# Altium project LED_matrix.PrjPcb
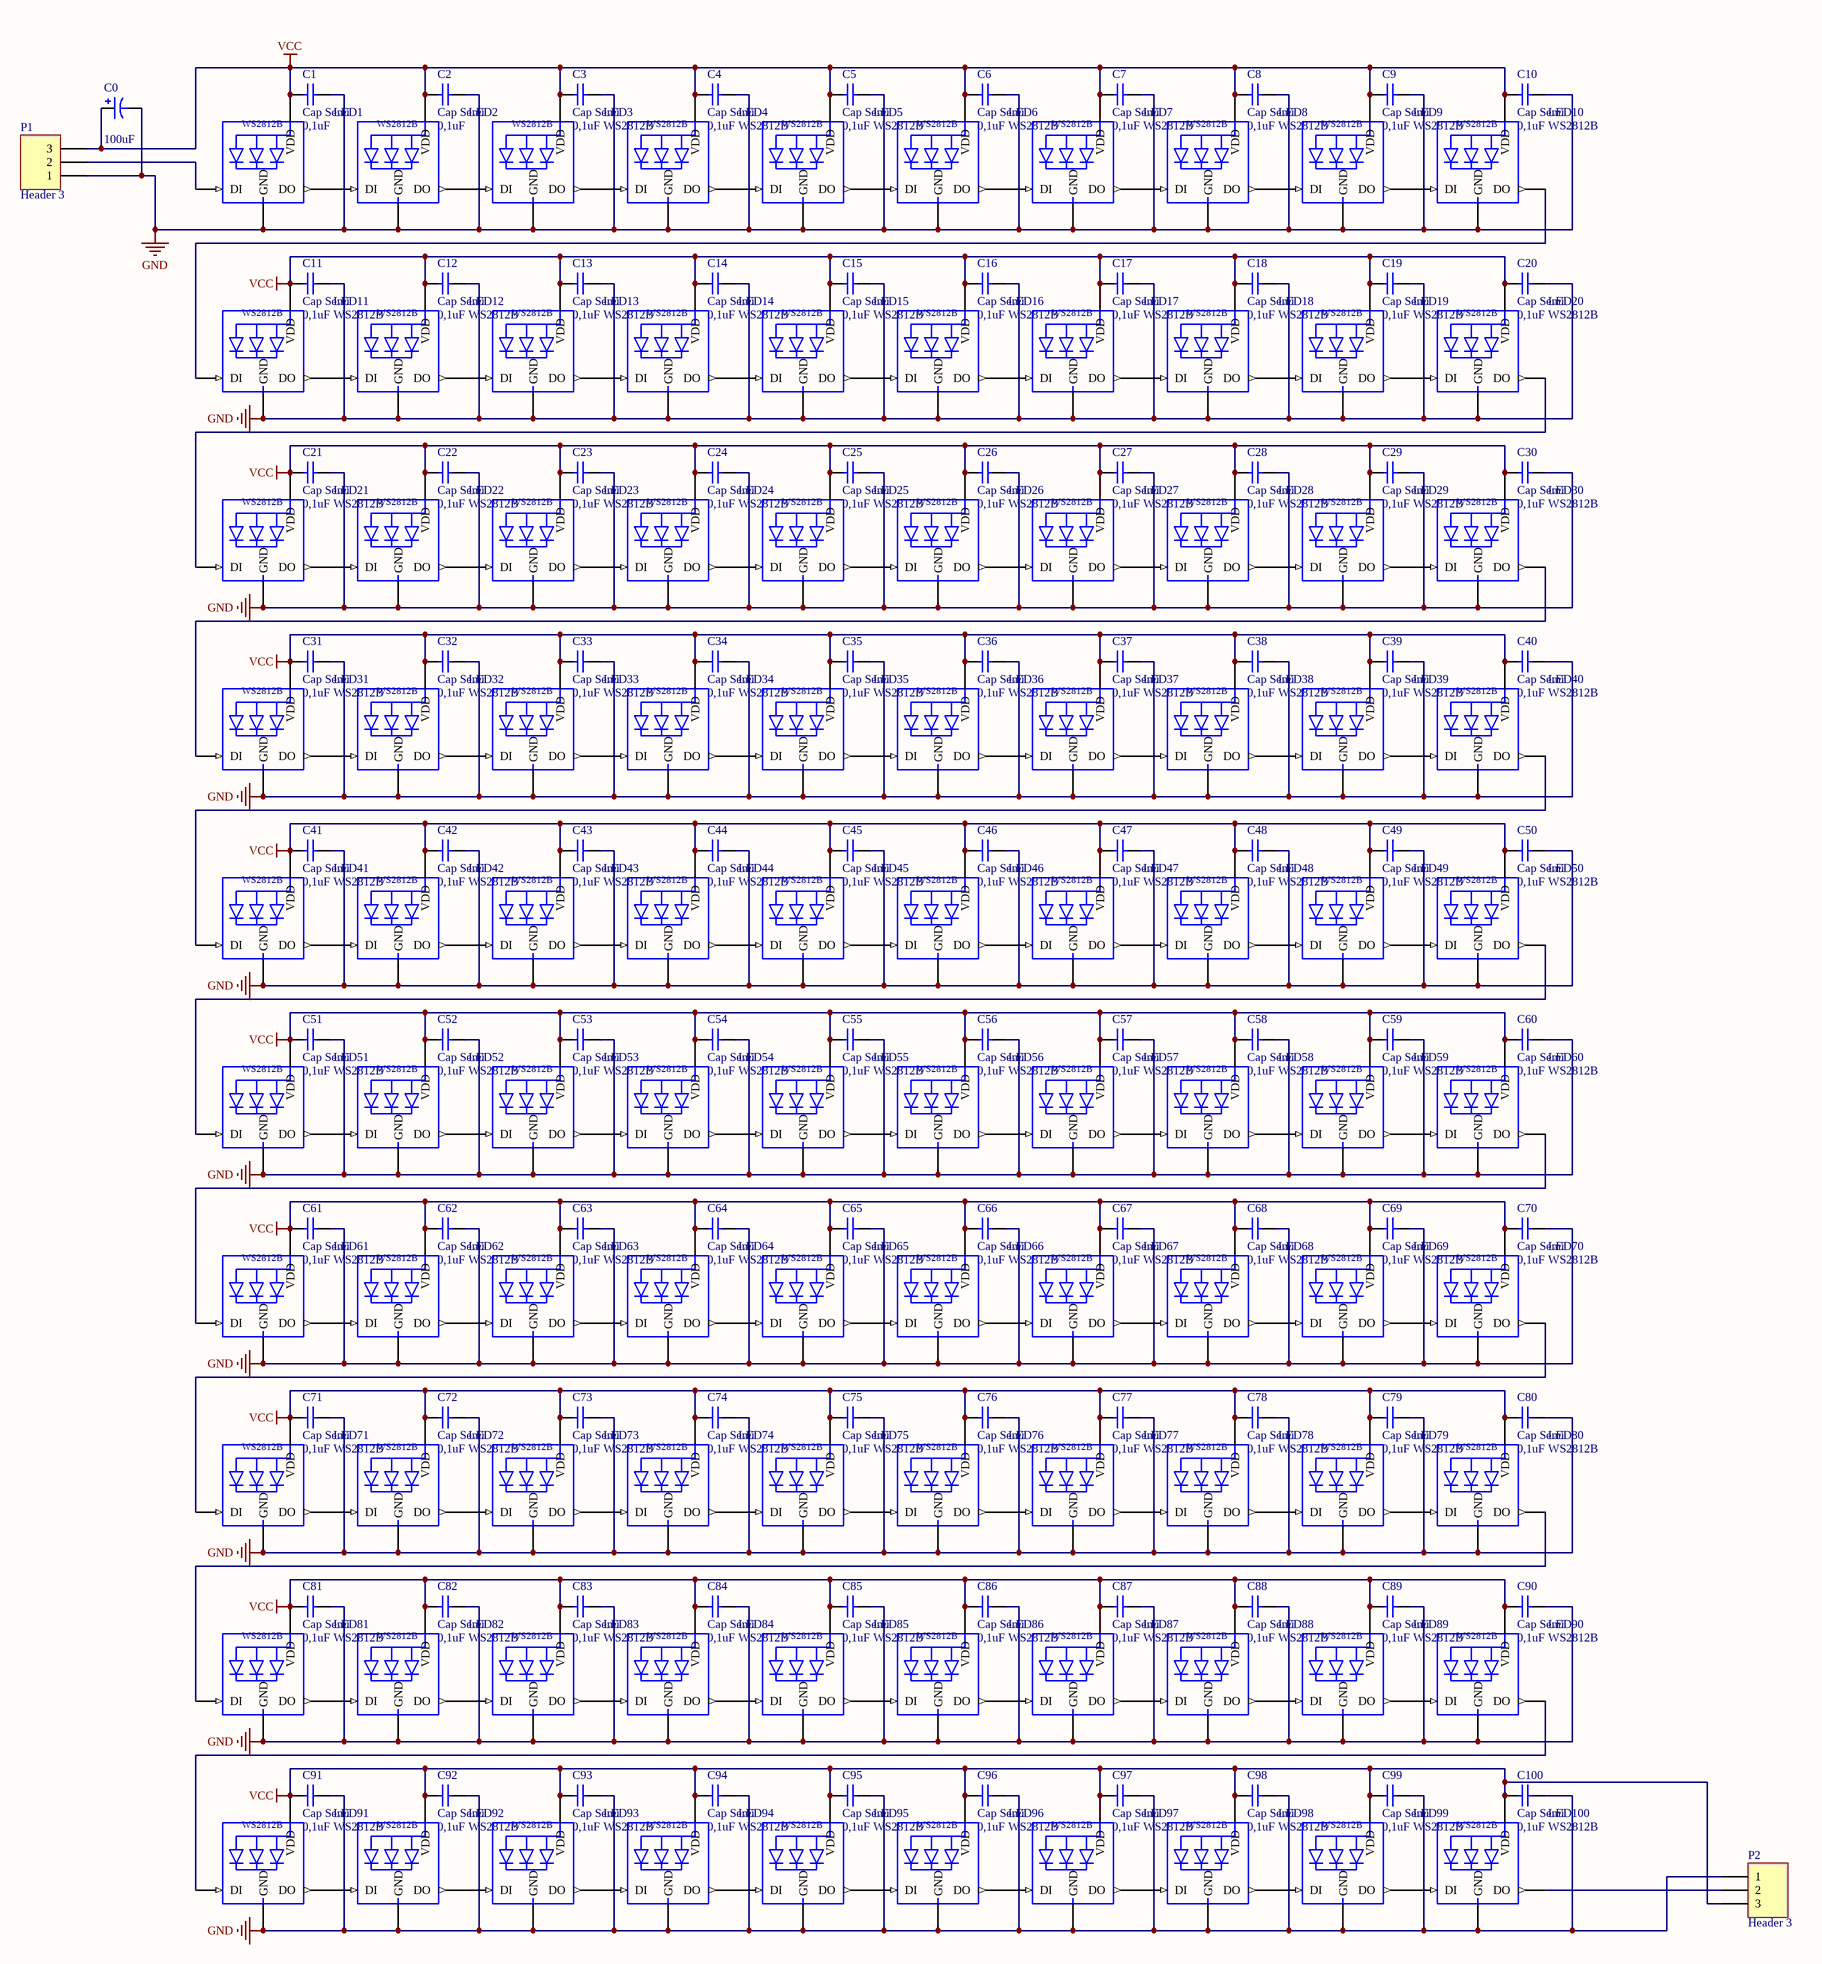
[diagram p0: Sheet1.SchDoc]
1 sheet, 203 parts. Net scope: global (net labels, ports and power ports of the same name join across sheets).

## Sheet Sheet1.SchDoc
size A2; PageSetup: Record=PageOptions|CenterHorizontal=True|CenterVertical=True|PrintScale=1.39|XCorrection=1.00|YCorrection=1.00|PrintKind=1|BorderSize=5000000|LeftOffset=0|BottomOffset=0|Orientation=2|PaperLength=1000|PaperWidth=1000|Scale=100|PaperSource=7|PrintQuality=-3|MediaType=1|DitherType=10|PrintScaleMode=1|PaperKind=A3 (Scaled)|PaperIndex=8

### Parts
C0  value 100uF  [RB7.6-15]  (hidden comment: Cap Pol1)
C1  Cap Semi  value 0,1uF  [1608[0603]]
C2  Cap Semi  value 0,1uF  [1608[0603]]
C3  Cap Semi  value 0,1uF  [1608[0603]]
C4  Cap Semi  value 0,1uF  [1608[0603]]
C5  Cap Semi  value 0,1uF  [1608[0603]]
C6  Cap Semi  value 0,1uF  [1608[0603]]
C7  Cap Semi  value 0,1uF  [1608[0603]]
C8  Cap Semi  value 0,1uF  [1608[0603]]
C9  Cap Semi  value 0,1uF  [1608[0603]]
C10  Cap Semi  value 0,1uF  [1608[0603]]
C11  Cap Semi  value 0,1uF  [1608[0603]]
C12  Cap Semi  value 0,1uF  [1608[0603]]
C13  Cap Semi  value 0,1uF  [1608[0603]]
C14  Cap Semi  value 0,1uF  [1608[0603]]
C15  Cap Semi  value 0,1uF  [1608[0603]]
C16  Cap Semi  value 0,1uF  [1608[0603]]
C17  Cap Semi  value 0,1uF  [1608[0603]]
C18  Cap Semi  value 0,1uF  [1608[0603]]
C19  Cap Semi  value 0,1uF  [1608[0603]]
C20  Cap Semi  value 0,1uF  [1608[0603]]
C21  Cap Semi  value 0,1uF  [1608[0603]]
C22  Cap Semi  value 0,1uF  [1608[0603]]
C23  Cap Semi  value 0,1uF  [1608[0603]]
C24  Cap Semi  value 0,1uF  [1608[0603]]
C25  Cap Semi  value 0,1uF  [1608[0603]]
C26  Cap Semi  value 0,1uF  [1608[0603]]
C27  Cap Semi  value 0,1uF  [1608[0603]]
C28  Cap Semi  value 0,1uF  [1608[0603]]
C29  Cap Semi  value 0,1uF  [1608[0603]]
C30  Cap Semi  value 0,1uF  [1608[0603]]
C31  Cap Semi  value 0,1uF  [1608[0603]]
C32  Cap Semi  value 0,1uF  [1608[0603]]
C33  Cap Semi  value 0,1uF  [1608[0603]]
C34  Cap Semi  value 0,1uF  [1608[0603]]
C35  Cap Semi  value 0,1uF  [1608[0603]]
C36  Cap Semi  value 0,1uF  [1608[0603]]
C37  Cap Semi  value 0,1uF  [1608[0603]]
C38  Cap Semi  value 0,1uF  [1608[0603]]
C39  Cap Semi  value 0,1uF  [1608[0603]]
C40  Cap Semi  value 0,1uF  [1608[0603]]
C41  Cap Semi  value 0,1uF  [1608[0603]]
C42  Cap Semi  value 0,1uF  [1608[0603]]
C43  Cap Semi  value 0,1uF  [1608[0603]]
C44  Cap Semi  value 0,1uF  [1608[0603]]
C45  Cap Semi  value 0,1uF  [1608[0603]]
C46  Cap Semi  value 0,1uF  [1608[0603]]
C47  Cap Semi  value 0,1uF  [1608[0603]]
C48  Cap Semi  value 0,1uF  [1608[0603]]
C49  Cap Semi  value 0,1uF  [1608[0603]]
C50  Cap Semi  value 0,1uF  [1608[0603]]
C51  Cap Semi  value 0,1uF  [1608[0603]]
C52  Cap Semi  value 0,1uF  [1608[0603]]
C53  Cap Semi  value 0,1uF  [1608[0603]]
C54  Cap Semi  value 0,1uF  [1608[0603]]
C55  Cap Semi  value 0,1uF  [1608[0603]]
C56  Cap Semi  value 0,1uF  [1608[0603]]
C57  Cap Semi  value 0,1uF  [1608[0603]]
C58  Cap Semi  value 0,1uF  [1608[0603]]
C59  Cap Semi  value 0,1uF  [1608[0603]]
C60  Cap Semi  value 0,1uF  [1608[0603]]
C61  Cap Semi  value 0,1uF  [1608[0603]]
C62  Cap Semi  value 0,1uF  [1608[0603]]
C63  Cap Semi  value 0,1uF  [1608[0603]]
C64  Cap Semi  value 0,1uF  [1608[0603]]
C65  Cap Semi  value 0,1uF  [1608[0603]]
C66  Cap Semi  value 0,1uF  [1608[0603]]
C67  Cap Semi  value 0,1uF  [1608[0603]]
C68  Cap Semi  value 0,1uF  [1608[0603]]
C69  Cap Semi  value 0,1uF  [1608[0603]]
C70  Cap Semi  value 0,1uF  [1608[0603]]
C71  Cap Semi  value 0,1uF  [1608[0603]]
C72  Cap Semi  value 0,1uF  [1608[0603]]
C73  Cap Semi  value 0,1uF  [1608[0603]]
C74  Cap Semi  value 0,1uF  [1608[0603]]
C75  Cap Semi  value 0,1uF  [1608[0603]]
C76  Cap Semi  value 0,1uF  [1608[0603]]
C77  Cap Semi  value 0,1uF  [1608[0603]]
C78  Cap Semi  value 0,1uF  [1608[0603]]
C79  Cap Semi  value 0,1uF  [1608[0603]]
C80  Cap Semi  value 0,1uF  [1608[0603]]
C81  Cap Semi  value 0,1uF  [1608[0603]]
C82  Cap Semi  value 0,1uF  [1608[0603]]
C83  Cap Semi  value 0,1uF  [1608[0603]]
C84  Cap Semi  value 0,1uF  [1608[0603]]
C85  Cap Semi  value 0,1uF  [1608[0603]]
C86  Cap Semi  value 0,1uF  [1608[0603]]
C87  Cap Semi  value 0,1uF  [1608[0603]]
C88  Cap Semi  value 0,1uF  [1608[0603]]
C89  Cap Semi  value 0,1uF  [1608[0603]]
C90  Cap Semi  value 0,1uF  [1608[0603]]
C91  Cap Semi  value 0,1uF  [1608[0603]]
C92  Cap Semi  value 0,1uF  [1608[0603]]
C93  Cap Semi  value 0,1uF  [1608[0603]]
C94  Cap Semi  value 0,1uF  [1608[0603]]
C95  Cap Semi  value 0,1uF  [1608[0603]]
C96  Cap Semi  value 0,1uF  [1608[0603]]
C97  Cap Semi  value 0,1uF  [1608[0603]]
C98  Cap Semi  value 0,1uF  [1608[0603]]
C99  Cap Semi  value 0,1uF  [1608[0603]]
C100  Cap Semi  value 0,1uF  [1608[0603]]
LED1  WS2812B  [WS2812B]  (value not drawn)
LED2  WS2812B  [WS2812B]  (value not drawn)
LED3  WS2812B  [WS2812B]
LED4  WS2812B  [WS2812B]
LED5  WS2812B  [WS2812B]
LED6  WS2812B  [WS2812B]
LED7  WS2812B  [WS2812B]
LED8  WS2812B  [WS2812B]
LED9  WS2812B  [WS2812B]
LED10  WS2812B  [WS2812B]
LED11  WS2812B  [WS2812B]
LED12  WS2812B  [WS2812B]
LED13  WS2812B  [WS2812B]
LED14  WS2812B  [WS2812B]
LED15  WS2812B  [WS2812B]
LED16  WS2812B  [WS2812B]
LED17  WS2812B  [WS2812B]
LED18  WS2812B  [WS2812B]
LED19  WS2812B  [WS2812B]
LED20  WS2812B  [WS2812B]
LED21  WS2812B  [WS2812B]
LED22  WS2812B  [WS2812B]
LED23  WS2812B  [WS2812B]
LED24  WS2812B  [WS2812B]
LED25  WS2812B  [WS2812B]
LED26  WS2812B  [WS2812B]
LED27  WS2812B  [WS2812B]
LED28  WS2812B  [WS2812B]
LED29  WS2812B  [WS2812B]
LED30  WS2812B  [WS2812B]
LED31  WS2812B  [WS2812B]
LED32  WS2812B  [WS2812B]
LED33  WS2812B  [WS2812B]
LED34  WS2812B  [WS2812B]
LED35  WS2812B  [WS2812B]
LED36  WS2812B  [WS2812B]
LED37  WS2812B  [WS2812B]
LED38  WS2812B  [WS2812B]
LED39  WS2812B  [WS2812B]
LED40  WS2812B  [WS2812B]
LED41  WS2812B  [WS2812B]
LED42  WS2812B  [WS2812B]
LED43  WS2812B  [WS2812B]
LED44  WS2812B  [WS2812B]
LED45  WS2812B  [WS2812B]
LED46  WS2812B  [WS2812B]
LED47  WS2812B  [WS2812B]
LED48  WS2812B  [WS2812B]
LED49  WS2812B  [WS2812B]
LED50  WS2812B  [WS2812B]
LED51  WS2812B  [WS2812B]
LED52  WS2812B  [WS2812B]
LED53  WS2812B  [WS2812B]
LED54  WS2812B  [WS2812B]
LED55  WS2812B  [WS2812B]
LED56  WS2812B  [WS2812B]
LED57  WS2812B  [WS2812B]
LED58  WS2812B  [WS2812B]
LED59  WS2812B  [WS2812B]
LED60  WS2812B  [WS2812B]
LED61  WS2812B  [WS2812B]
LED62  WS2812B  [WS2812B]
LED63  WS2812B  [WS2812B]
LED64  WS2812B  [WS2812B]
LED65  WS2812B  [WS2812B]
LED66  WS2812B  [WS2812B]
LED67  WS2812B  [WS2812B]
LED68  WS2812B  [WS2812B]
LED69  WS2812B  [WS2812B]
LED70  WS2812B  [WS2812B]
LED71  WS2812B  [WS2812B]
LED72  WS2812B  [WS2812B]
LED73  WS2812B  [WS2812B]
LED74  WS2812B  [WS2812B]
LED75  WS2812B  [WS2812B]
LED76  WS2812B  [WS2812B]
LED77  WS2812B  [WS2812B]
LED78  WS2812B  [WS2812B]
LED79  WS2812B  [WS2812B]
LED80  WS2812B  [WS2812B]
LED81  WS2812B  [WS2812B]
LED82  WS2812B  [WS2812B]
LED83  WS2812B  [WS2812B]
LED84  WS2812B  [WS2812B]
LED85  WS2812B  [WS2812B]
LED86  WS2812B  [WS2812B]
LED87  WS2812B  [WS2812B]
LED88  WS2812B  [WS2812B]
LED89  WS2812B  [WS2812B]
LED90  WS2812B  [WS2812B]
LED91  WS2812B  [WS2812B]
LED92  WS2812B  [WS2812B]
LED93  WS2812B  [WS2812B]
LED94  WS2812B  [WS2812B]
LED95  WS2812B  [WS2812B]
LED96  WS2812B  [WS2812B]
LED97  WS2812B  [WS2812B]
LED98  WS2812B  [WS2812B]
LED99  WS2812B  [WS2812B]
LED100  WS2812B  [WS2812B]
P1  Header 3  [HDR1X3]
P2  Header 3  [HDR1X3]

### Nets
GND: C0.2 C1.2 C2.2 C3.2 C4.2 C5.2 C6.2 C7.2 C8.2 C9.2 C10.2 C11.2 C12.2 C13.2 C14.2 C15.2 C16.2 C17.2 C18.2 C19.2 C20.2 C21.2 C22.2 C23.2 C24.2 C25.2 C26.2 C27.2 C28.2 C29.2 C30.2 C31.2 C32.2 C33.2 C34.2 C35.2 C36.2 C37.2 C38.2 C39.2 C40.2 C41.2 C42.2 C43.2 C44.2 C45.2 C46.2 C47.2 C48.2 C49.2 C50.2 C51.2 C52.2 C53.2 C54.2 C55.2 C56.2 C57.2 C58.2 C59.2 C60.2 C61.2 C62.2 C63.2 C64.2 C65.2 C66.2 C67.2 C68.2 C69.2 C70.2 C71.2 C72.2 C73.2 C74.2 C75.2 C76.2 C77.2 C78.2 C79.2 C80.2 C81.2 C82.2 C83.2 C84.2 C85.2 C86.2 C87.2 C88.2 C89.2 C90.2 C91.2 C92.2 C93.2 C94.2 C95.2 C96.2 C97.2 C98.2 C99.2 C100.2 LED1.3-GND(GND) LED2.3-GND(GND) LED3.3-GND(GND) LED4.3-GND(GND) LED5.3-GND(GND) LED6.3-GND(GND) LED7.3-GND(GND) LED8.3-GND(GND) LED9.3-GND(GND) LED10.3-GND(GND) LED11.3-GND(GND) LED12.3-GND(GND) LED13.3-GND(GND) LED14.3-GND(GND) LED15.3-GND(GND) LED16.3-GND(GND) LED17.3-GND(GND) LED18.3-GND(GND) LED19.3-GND(GND) LED20.3-GND(GND) LED21.3-GND(GND) LED22.3-GND(GND) LED23.3-GND(GND) LED24.3-GND(GND) LED25.3-GND(GND) LED26.3-GND(GND) LED27.3-GND(GND) LED28.3-GND(GND) LED29.3-GND(GND) LED30.3-GND(GND) LED31.3-GND(GND) LED32.3-GND(GND) LED33.3-GND(GND) LED34.3-GND(GND) LED35.3-GND(GND) LED36.3-GND(GND) LED37.3-GND(GND) LED38.3-GND(GND) LED39.3-GND(GND) LED40.3-GND(GND) LED41.3-GND(GND) LED42.3-GND(GND) LED43.3-GND(GND) LED44.3-GND(GND) LED45.3-GND(GND) LED46.3-GND(GND) LED47.3-GND(GND) LED48.3-GND(GND) LED49.3-GND(GND) LED50.3-GND(GND) LED51.3-GND(GND) LED52.3-GND(GND) LED53.3-GND(GND) LED54.3-GND(GND) LED55.3-GND(GND) LED56.3-GND(GND) LED57.3-GND(GND) LED58.3-GND(GND) LED59.3-GND(GND) LED60.3-GND(GND) LED61.3-GND(GND) LED62.3-GND(GND) LED63.3-GND(GND) LED64.3-GND(GND) LED65.3-GND(GND) LED66.3-GND(GND) LED67.3-GND(GND) LED68.3-GND(GND) LED69.3-GND(GND) LED70.3-GND(GND) LED71.3-GND(GND) LED72.3-GND(GND) LED73.3-GND(GND) LED74.3-GND(GND) LED75.3-GND(GND) LED76.3-GND(GND) LED77.3-GND(GND) LED78.3-GND(GND) LED79.3-GND(GND) LED80.3-GND(GND) LED81.3-GND(GND) LED82.3-GND(GND) LED83.3-GND(GND) LED84.3-GND(GND) LED85.3-GND(GND) LED86.3-GND(GND) LED87.3-GND(GND) LED88.3-GND(GND) LED89.3-GND(GND) LED90.3-GND(GND) LED91.3-GND(GND) LED92.3-GND(GND) LED93.3-GND(GND) LED94.3-GND(GND) LED95.3-GND(GND) LED96.3-GND(GND) LED97.3-GND(GND) LED98.3-GND(GND) LED99.3-GND(GND) LED100.3-GND(GND) P1.1 P2.1
VCC: C0.1 C1.1 C2.1 C3.1 C4.1 C5.1 C6.1 C7.1 C8.1 C9.1 C10.1 C11.1 C12.1 C13.1 C14.1 C15.1 C16.1 C17.1 C18.1 C19.1 C20.1 C21.1 C22.1 C23.1 C24.1 C25.1 C26.1 C27.1 C28.1 C29.1 C30.1 C31.1 C32.1 C33.1 C34.1 C35.1 C36.1 C37.1 C38.1 C39.1 C40.1 C41.1 C42.1 C43.1 C44.1 C45.1 C46.1 C47.1 C48.1 C49.1 C50.1 C51.1 C52.1 C53.1 C54.1 C55.1 C56.1 C57.1 C58.1 C59.1 C60.1 C61.1 C62.1 C63.1 C64.1 C65.1 C66.1 C67.1 C68.1 C69.1 C70.1 C71.1 C72.1 C73.1 C74.1 C75.1 C76.1 C77.1 C78.1 C79.1 C80.1 C81.1 C82.1 C83.1 C84.1 C85.1 C86.1 C87.1 C88.1 C89.1 C90.1 C91.1 C92.1 C93.1 C94.1 C95.1 C96.1 C97.1 C98.1 C99.1 C100.1 LED1.1-VDD(VDD) LED2.1-VDD(VDD) LED3.1-VDD(VDD) LED4.1-VDD(VDD) LED5.1-VDD(VDD) LED6.1-VDD(VDD) LED7.1-VDD(VDD) LED8.1-VDD(VDD) LED9.1-VDD(VDD) LED10.1-VDD(VDD) LED11.1-VDD(VDD) LED12.1-VDD(VDD) LED13.1-VDD(VDD) LED14.1-VDD(VDD) LED15.1-VDD(VDD) LED16.1-VDD(VDD) LED17.1-VDD(VDD) LED18.1-VDD(VDD) LED19.1-VDD(VDD) LED20.1-VDD(VDD) LED21.1-VDD(VDD) LED22.1-VDD(VDD) LED23.1-VDD(VDD) LED24.1-VDD(VDD) LED25.1-VDD(VDD) LED26.1-VDD(VDD) LED27.1-VDD(VDD) LED28.1-VDD(VDD) LED29.1-VDD(VDD) LED30.1-VDD(VDD) LED31.1-VDD(VDD) LED32.1-VDD(VDD) LED33.1-VDD(VDD) LED34.1-VDD(VDD) LED35.1-VDD(VDD) LED36.1-VDD(VDD) LED37.1-VDD(VDD) LED38.1-VDD(VDD) LED39.1-VDD(VDD) LED40.1-VDD(VDD) LED41.1-VDD(VDD) LED42.1-VDD(VDD) LED43.1-VDD(VDD) LED44.1-VDD(VDD) LED45.1-VDD(VDD) LED46.1-VDD(VDD) LED47.1-VDD(VDD) LED48.1-VDD(VDD) LED49.1-VDD(VDD) LED50.1-VDD(VDD) LED51.1-VDD(VDD) LED52.1-VDD(VDD) LED53.1-VDD(VDD) LED54.1-VDD(VDD) LED55.1-VDD(VDD) LED56.1-VDD(VDD) LED57.1-VDD(VDD) LED58.1-VDD(VDD) LED59.1-VDD(VDD) LED60.1-VDD(VDD) LED61.1-VDD(VDD) LED62.1-VDD(VDD) LED63.1-VDD(VDD) LED64.1-VDD(VDD) LED65.1-VDD(VDD) LED66.1-VDD(VDD) LED67.1-VDD(VDD) LED68.1-VDD(VDD) LED69.1-VDD(VDD) LED70.1-VDD(VDD) LED71.1-VDD(VDD) LED72.1-VDD(VDD) LED73.1-VDD(VDD) LED74.1-VDD(VDD) LED75.1-VDD(VDD) LED76.1-VDD(VDD) LED77.1-VDD(VDD) LED78.1-VDD(VDD) LED79.1-VDD(VDD) LED80.1-VDD(VDD) LED81.1-VDD(VDD) LED82.1-VDD(VDD) LED83.1-VDD(VDD) LED84.1-VDD(VDD) LED85.1-VDD(VDD) LED86.1-VDD(VDD) LED87.1-VDD(VDD) LED88.1-VDD(VDD) LED89.1-VDD(VDD) LED90.1-VDD(VDD) LED91.1-VDD(VDD) LED92.1-VDD(VDD) LED93.1-VDD(VDD) LED94.1-VDD(VDD) LED95.1-VDD(VDD) LED96.1-VDD(VDD) LED97.1-VDD(VDD) LED98.1-VDD(VDD) LED99.1-VDD(VDD) LED100.1-VDD(VDD) P1.3 P2.3
NetLED1_2-DOUT: LED1.2-DOUT(DO) LED2.4-DIN(DI)
NetLED1_4-DIN: LED1.4-DIN(DI) P1.2
NetLED2_2-DOUT: LED2.2-DOUT(DO) LED3.4-DIN(DI)
NetLED3_2-DOUT: LED3.2-DOUT(DO) LED4.4-DIN(DI)
NetLED4_2-DOUT: LED4.2-DOUT(DO) LED5.4-DIN(DI)
NetLED5_2-DOUT: LED5.2-DOUT(DO) LED6.4-DIN(DI)
NetLED6_2-DOUT: LED6.2-DOUT(DO) LED7.4-DIN(DI)
NetLED7_2-DOUT: LED7.2-DOUT(DO) LED8.4-DIN(DI)
NetLED8_2-DOUT: LED8.2-DOUT(DO) LED9.4-DIN(DI)
NetLED9_2-DOUT: LED9.2-DOUT(DO) LED10.4-DIN(DI)
NetLED10_2-DOUT: LED10.2-DOUT(DO) LED11.4-DIN(DI)
NetLED11_2-DOUT: LED11.2-DOUT(DO) LED12.4-DIN(DI)
NetLED12_2-DOUT: LED12.2-DOUT(DO) LED13.4-DIN(DI)
NetLED13_2-DOUT: LED13.2-DOUT(DO) LED14.4-DIN(DI)
NetLED14_2-DOUT: LED14.2-DOUT(DO) LED15.4-DIN(DI)
NetLED15_2-DOUT: LED15.2-DOUT(DO) LED16.4-DIN(DI)
NetLED16_2-DOUT: LED16.2-DOUT(DO) LED17.4-DIN(DI)
NetLED17_2-DOUT: LED17.2-DOUT(DO) LED18.4-DIN(DI)
NetLED18_2-DOUT: LED18.2-DOUT(DO) LED19.4-DIN(DI)
NetLED19_2-DOUT: LED19.2-DOUT(DO) LED20.4-DIN(DI)
NetLED20_2-DOUT: LED20.2-DOUT(DO) LED21.4-DIN(DI)
NetLED21_2-DOUT: LED21.2-DOUT(DO) LED22.4-DIN(DI)
NetLED22_2-DOUT: LED22.2-DOUT(DO) LED23.4-DIN(DI)
NetLED23_2-DOUT: LED23.2-DOUT(DO) LED24.4-DIN(DI)
NetLED24_2-DOUT: LED24.2-DOUT(DO) LED25.4-DIN(DI)
NetLED25_2-DOUT: LED25.2-DOUT(DO) LED26.4-DIN(DI)
NetLED26_2-DOUT: LED26.2-DOUT(DO) LED27.4-DIN(DI)
NetLED27_2-DOUT: LED27.2-DOUT(DO) LED28.4-DIN(DI)
NetLED28_2-DOUT: LED28.2-DOUT(DO) LED29.4-DIN(DI)
NetLED29_2-DOUT: LED29.2-DOUT(DO) LED30.4-DIN(DI)
NetLED30_2-DOUT: LED30.2-DOUT(DO) LED31.4-DIN(DI)
NetLED31_2-DOUT: LED31.2-DOUT(DO) LED32.4-DIN(DI)
NetLED32_2-DOUT: LED32.2-DOUT(DO) LED33.4-DIN(DI)
NetLED33_2-DOUT: LED33.2-DOUT(DO) LED34.4-DIN(DI)
NetLED34_2-DOUT: LED34.2-DOUT(DO) LED35.4-DIN(DI)
NetLED35_2-DOUT: LED35.2-DOUT(DO) LED36.4-DIN(DI)
NetLED36_2-DOUT: LED36.2-DOUT(DO) LED37.4-DIN(DI)
NetLED37_2-DOUT: LED37.2-DOUT(DO) LED38.4-DIN(DI)
NetLED38_2-DOUT: LED38.2-DOUT(DO) LED39.4-DIN(DI)
NetLED39_2-DOUT: LED39.2-DOUT(DO) LED40.4-DIN(DI)
NetLED40_2-DOUT: LED40.2-DOUT(DO) LED41.4-DIN(DI)
NetLED41_2-DOUT: LED41.2-DOUT(DO) LED42.4-DIN(DI)
NetLED42_2-DOUT: LED42.2-DOUT(DO) LED43.4-DIN(DI)
NetLED43_2-DOUT: LED43.2-DOUT(DO) LED44.4-DIN(DI)
NetLED44_2-DOUT: LED44.2-DOUT(DO) LED45.4-DIN(DI)
NetLED45_2-DOUT: LED45.2-DOUT(DO) LED46.4-DIN(DI)
NetLED46_2-DOUT: LED46.2-DOUT(DO) LED47.4-DIN(DI)
NetLED47_2-DOUT: LED47.2-DOUT(DO) LED48.4-DIN(DI)
NetLED48_2-DOUT: LED48.2-DOUT(DO) LED49.4-DIN(DI)
NetLED49_2-DOUT: LED49.2-DOUT(DO) LED50.4-DIN(DI)
NetLED50_2-DOUT: LED50.2-DOUT(DO) LED51.4-DIN(DI)
NetLED51_2-DOUT: LED51.2-DOUT(DO) LED52.4-DIN(DI)
NetLED52_2-DOUT: LED52.2-DOUT(DO) LED53.4-DIN(DI)
NetLED53_2-DOUT: LED53.2-DOUT(DO) LED54.4-DIN(DI)
NetLED54_2-DOUT: LED54.2-DOUT(DO) LED55.4-DIN(DI)
NetLED55_2-DOUT: LED55.2-DOUT(DO) LED56.4-DIN(DI)
NetLED56_2-DOUT: LED56.2-DOUT(DO) LED57.4-DIN(DI)
NetLED57_2-DOUT: LED57.2-DOUT(DO) LED58.4-DIN(DI)
NetLED58_2-DOUT: LED58.2-DOUT(DO) LED59.4-DIN(DI)
NetLED59_2-DOUT: LED59.2-DOUT(DO) LED60.4-DIN(DI)
NetLED60_2-DOUT: LED60.2-DOUT(DO) LED61.4-DIN(DI)
NetLED61_2-DOUT: LED61.2-DOUT(DO) LED62.4-DIN(DI)
NetLED62_2-DOUT: LED62.2-DOUT(DO) LED63.4-DIN(DI)
NetLED63_2-DOUT: LED63.2-DOUT(DO) LED64.4-DIN(DI)
NetLED64_2-DOUT: LED64.2-DOUT(DO) LED65.4-DIN(DI)
NetLED65_2-DOUT: LED65.2-DOUT(DO) LED66.4-DIN(DI)
NetLED66_2-DOUT: LED66.2-DOUT(DO) LED67.4-DIN(DI)
NetLED67_2-DOUT: LED67.2-DOUT(DO) LED68.4-DIN(DI)
NetLED68_2-DOUT: LED68.2-DOUT(DO) LED69.4-DIN(DI)
NetLED69_2-DOUT: LED69.2-DOUT(DO) LED70.4-DIN(DI)
NetLED70_2-DOUT: LED70.2-DOUT(DO) LED71.4-DIN(DI)
NetLED71_2-DOUT: LED71.2-DOUT(DO) LED72.4-DIN(DI)
NetLED72_2-DOUT: LED72.2-DOUT(DO) LED73.4-DIN(DI)
NetLED73_2-DOUT: LED73.2-DOUT(DO) LED74.4-DIN(DI)
NetLED74_2-DOUT: LED74.2-DOUT(DO) LED75.4-DIN(DI)
NetLED75_2-DOUT: LED75.2-DOUT(DO) LED76.4-DIN(DI)
NetLED76_2-DOUT: LED76.2-DOUT(DO) LED77.4-DIN(DI)
NetLED77_2-DOUT: LED77.2-DOUT(DO) LED78.4-DIN(DI)
NetLED78_2-DOUT: LED78.2-DOUT(DO) LED79.4-DIN(DI)
NetLED79_2-DOUT: LED79.2-DOUT(DO) LED80.4-DIN(DI)
NetLED80_2-DOUT: LED80.2-DOUT(DO) LED81.4-DIN(DI)
NetLED81_2-DOUT: LED81.2-DOUT(DO) LED82.4-DIN(DI)
NetLED82_2-DOUT: LED82.2-DOUT(DO) LED83.4-DIN(DI)
NetLED83_2-DOUT: LED83.2-DOUT(DO) LED84.4-DIN(DI)
NetLED84_2-DOUT: LED84.2-DOUT(DO) LED85.4-DIN(DI)
NetLED85_2-DOUT: LED85.2-DOUT(DO) LED86.4-DIN(DI)
NetLED86_2-DOUT: LED86.2-DOUT(DO) LED87.4-DIN(DI)
NetLED87_2-DOUT: LED87.2-DOUT(DO) LED88.4-DIN(DI)
NetLED88_2-DOUT: LED88.2-DOUT(DO) LED89.4-DIN(DI)
NetLED89_2-DOUT: LED89.2-DOUT(DO) LED90.4-DIN(DI)
NetLED90_2-DOUT: LED90.2-DOUT(DO) LED91.4-DIN(DI)
NetLED91_2-DOUT: LED91.2-DOUT(DO) LED92.4-DIN(DI)
NetLED92_2-DOUT: LED92.2-DOUT(DO) LED93.4-DIN(DI)
NetLED93_2-DOUT: LED93.2-DOUT(DO) LED94.4-DIN(DI)
NetLED94_2-DOUT: LED94.2-DOUT(DO) LED95.4-DIN(DI)
NetLED95_2-DOUT: LED95.2-DOUT(DO) LED96.4-DIN(DI)
NetLED96_2-DOUT: LED96.2-DOUT(DO) LED97.4-DIN(DI)
NetLED97_2-DOUT: LED97.2-DOUT(DO) LED98.4-DIN(DI)
NetLED98_2-DOUT: LED98.2-DOUT(DO) LED99.4-DIN(DI)
NetLED99_2-DOUT: LED99.2-DOUT(DO) LED100.4-DIN(DI)
NetLED100_2-DOUT: LED100.2-DOUT(DO) P2.2

### Library data of the parts
C0 = Cap Pol1: Polarized Capacitor (Radial); Published: 8-Jun-2000; LatestRevisionDate: 17-Jul-2002; LatestRevisionNote: Re-released for DXP Platform.; PackageReference: RB7.6-15; Publisher: Altium Limited; PackageDescription: Polarized Capacitor (Radial); 2 Leads
C1-C100 = Cap Semi: Capacitor (Semiconductor SIM Model); Published: 8-Jun-2000; LatestRevisionDate: 29-May-2009; LatestRevisionNote: IPC-7351 Footprint Added.; PackageReference: C1206; Publisher: Altium Limited; PackageDescription: Chip Capacitor
LED1-LED100 = WS2812B: Raspberry Pi HAT _40 pin_ Wheeled Robotics Kit; MF: SparkFun Electronics; Availability: Unavailable; SnapEDA_Link: https://www.snapeda.com/parts/WS2812B/Worldsemi/view-part/1038297/?ref=snap; MP: WS2812B; Price: None; Value: *; Package: None
P1 P2 = Header 3: Header, 3-Pin; LatestRevisionDate: 17-Jul-2002; LatestRevisionNote: Re-released for DXP Platform.; Publisher: Altium Limited